# Altium project LoRa.PrjPcb
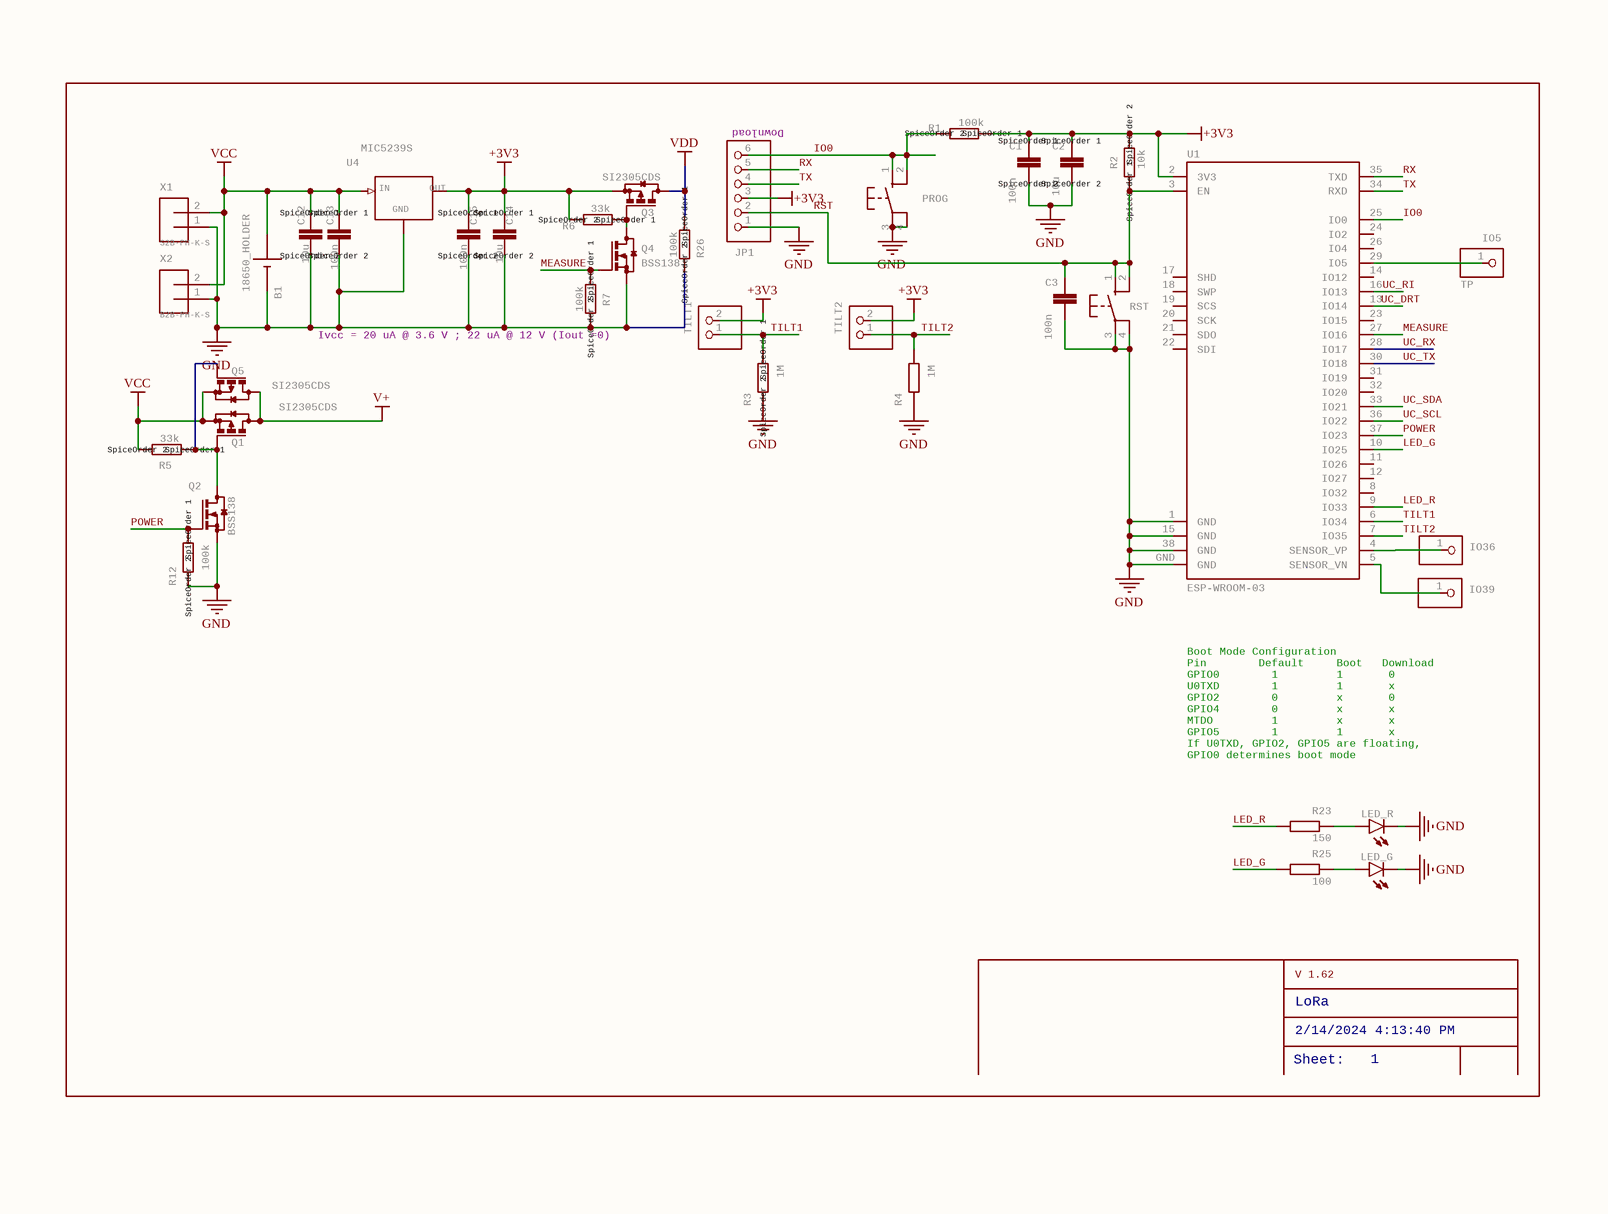
[diagram p0: LoRa_0.SchDoc]
2 sheets, 79 parts. Net scope: global (net labels, ports and power ports of the same name join across sheets).
Sheets:
  LoRa_0.SchDoc
  LoRa_1.SchDoc

## Sheet LoRa_0.SchDoc: LoRa
size 282 x 212 mm; Origin: Eagle; Date: 2/14/2024 4:13:40 PM; SheetNumber: 1; GateName_1: G$1; SymbolName_1: A4L-LOC; LibraryName: frames; DeviceSetName: A4L-LOC; Sheet: Sheet:

### Parts
B1  18650_HOLDER  [18650]
C1  100n  SpiceOrder1: SpiceOrder 1  SpiceOrder2: SpiceOrder 2  [C1206]
C2  10u  SpiceOrder1: SpiceOrder 1  SpiceOrder2: SpiceOrder 2  [C1210]
C3  100n  [C1206]
C12  10u  SpiceOrder1: SpiceOrder 1  SpiceOrder2: SpiceOrder 2  [C1210]
C13  100n  SpiceOrder1: SpiceOrder 1  SpiceOrder2: SpiceOrder 2  [C1206]
C14  10u  SpiceOrder1: SpiceOrder 1  SpiceOrder2: SpiceOrder 2  [C1210]
C15  100n  SpiceOrder1: SpiceOrder 1  SpiceOrder2: SpiceOrder 2  [C1206]
IO5  TP  [1X01]
IO36  PINHD-1X1  [1X01]  (value not drawn)
IO39  PINHD-1X1  [1X01]  (value not drawn)
JP1  PINHD-1X6  [1X06]  (value not drawn)
LED_G  LEDSMT1206  [1206]  (value not drawn)
LED_R  LEDSMT1206  [1206]  (value not drawn)
PROG  10-XX  [B3F-10XX]  (value not drawn)
Q1  SI2305CDS  [SOT23]
Q2  BSS138  [SOT23]
Q3  SI2305CDS  [SOT23]
Q4  BSS138  [SOT23]
Q5  SI2305CDS  [SOT23]
R1  100k  SpiceOrder1: SpiceOrder 1  SpiceOrder2: SpiceOrder 2  [R1206]
R2  10k  SpiceOrder1: SpiceOrder 1  SpiceOrder2: SpiceOrder 2  [R1206]
R3  1M  SpiceOrder1: SpiceOrder 1  SpiceOrder2: SpiceOrder 2  [R1206]
R4  1M  [R1206]
R5  33k  SpiceOrder1: SpiceOrder 1  SpiceOrder2: SpiceOrder 2  [R1206]
R6  33k  SpiceOrder1: SpiceOrder 1  SpiceOrder2: SpiceOrder 2  [R1206]
R7  100k  SpiceOrder1: SpiceOrder 1  SpiceOrder2: SpiceOrder 2  [R1206]
R12  100k  SpiceOrder1: SpiceOrder 1  SpiceOrder2: SpiceOrder 2  [R1206]
R23  150  [R1206]
R25  100  [R1206]
R26  100k  SpiceOrder1: SpiceOrder 1  SpiceOrder2: SpiceOrder 2  [R1206]
RST  10-XX  [B3F-10XX]  (value not drawn)
TILT1  PINHD-1X2  [1X02]  (value not drawn)
TILT2  PINHD-1X2  [1X02]  (value not drawn)
U1  ESP-WROOM-03  [ESP-WROOM-03]
U4  MIC5239S  [SOT223]
X1  S2B-PH-K-S  [S2B-PH-K-S]
X2  B2B-PH-K-S  [B2B-PH-K-S]

### Nets
+3V3: C1.1 C2.1 C14.1 C15.1 JP1.3 Q3.2(S) R1.1 R2.2 R6.2 TILT1.2 TILT2.2 U1.2(3V3) U4.3(OUT)
GND: B1.- C1.2 C2.2 C3.2 C12.2 C13.2 C14.2 C15.2 JP1.1 LED_G.C LED_R.C PROG.3(P) PROG.4(P1) Q2.2(S) Q4.2(S) R3.2 R4.2 R7.2 R12.2 R26.2 RST.3(P) RST.4(P1) U1.1(GND) U1.15(GND) U1.38(GND) U1.GND U4.2,4(GND) X1.1 X2.1
V+: Q1.3(D) Q5.3(D)
VCC: B1.+ C12.1 C13.1 Q1.2(S) Q5.2(S) R5.2 U4.1(IN) X1.2 X2.2
VDD: Q3.3(D) R26.1
IO0: JP1.6 PROG.1(S) PROG.2(S1) R1.2 U1.25(IO0)
LED_G: R25.1 U1.10(IO25)
LED_R: R23.1 U1.9(IO33)
MEASURE: Q4.1(G) R7.1 U1.27(IO16)
POWER: Q2.1(G) R12.1 U1.37(IO23)
RST: C3.1 JP1.2 R2.1 RST.1(S) RST.2(S1) U1.3(EN)
RX: JP1.5 U1.35(TXD)
TILT1: R3.1 TILT1.1 U1.6(IO34)
TILT2: R4.1 TILT2.1 U1.7(IO35)
TX: JP1.4 U1.34(RXD)
UC_DRT: U1.13(IO14)
UC_RI: U1.16(IO13)
UC_RX: U1.28(IO17)
UC_SCL: U1.36(IO22)
UC_SDA: U1.33(IO21)
UC_TX: U1.30(IO18)
NetIO5_1: IO5.1 U1.29(IO5)
NetIO36_1: IO36.1 U1.4(SENSOR_VP)
NetIO39_1: IO39.1 U1.5(SENSOR_VN)
NetLED_G_A: LED_G.A R25.2
NetLED_R_A: LED_R.A R23.2
NetQ1_1: Q1.1(G) Q2.3(D) Q5.1(G) R5.1
NetQ3_1: Q3.1(G) Q4.3(D) R6.1

Not connected (* = marked no-connect by the designer): U1 8(IO32) 11(IO26) 12(IO27) 14(IO12) 17(SHD) 18(SWP) 19(SCS) 20(SCK) 21(SDO) 22(SDI) 23(IO15) 24(IO2) 26(IO4) 31(IO19) 32(IO20)

### Notes on the sheet
- (near JP1) Download
- (near R7) Ivcc = 20 uA @ 3.6 V ; 22 uA @ 12 V (Iout =0)
- Boot Mode Configuration
  Pin        Default     Boot   Download
  GPIO0        1         1       0
  U0TXD        1         1       x
  GPIO2        0         x       0
  GPIO4        0         x       x
  MTDO         1         x       x
  GPIO5        1         1       x
  If U0TXD, GPIO2, GPIO5 are floating,
  GPIO0 determines boot mode
- V 1.62
- LoRa
- Sheet:
- 2/14/2024 4:13:40 PM
- 1

### Library data of the parts
B1 = 18650_HOLDER: 18650 holder; GateName_1: G$1; SymbolName_1: 1V2; LibraryName: battery_bms; DeviceSetName: 18650_HOLDER
C1 C3 C13 C15 = CC1206: CAPACITOR, European symbol; GateName_1: G$1; SymbolName_1: C; DeviceName: C1206; LibraryName: eagle-ltspice; DeviceSetName: C; SPICEMODEL: NONE; SPICEPREFIX: C
C2 C12 C14 = CC1210: CAPACITOR, European symbol; GateName_1: G$1; SymbolName_1: C; DeviceName: C1210; LibraryName: eagle-ltspice; DeviceSetName: C; SPICEMODEL: NONE; SPICEPREFIX: C
IO5 IO36 IO39 = PINHD-1X1: PIN HEADER; GateName_1: G$1; SymbolName_1: PINHD1; POPULARITY: 64; LibraryName: pinhead; DeviceSetName: PINHD-1X1
JP1 = PINHD-1X6: PIN HEADER; GateName_1: A; SymbolName_1: PINHD6; POPULARITY: 79; LibraryName: pinhead; DeviceSetName: PINHD-1X6
LED_G LED_R = LEDSMT1206: LED   OSRAM: - CHIPLED LG R971, LG N971, LY N971, LG Q971, LY Q971, LO R971, LY R971 LH N974, LH R974 LS Q976, LO Q976, LY Q976 LO Q996 - Hyper CHIPLED LW Q18S LB Q993, LB Q99A, LB R99A - SideLED LS A670, LO A670, LY A670, LG A670, LP A670 LB A673, LV A673, LT A673, LW A673 LH A674 LY A675 LS A676, LA A676, LO A676, LY A676, LW A676 LS A679, LY A679, LG A679 -  Hyper Micro SIDELEDÂ® LS Y876, LA Y876, LO Y876, LY Y876 LT Y87S - SmartLED LW L88C, LW L88S LB L89C, LB L89S, LG L890 LS L89K, LO L89K, LY L89K LS L896, LA L896, LO L896, LY L896 - TOPLED LS T670, LO T670, LY T670, LG T670, LP T670 LSG T670, LSP T670, LSY T670, LOP T670, LYG T670 LG T671, LOG T671, LSG T671 LB T673, LV T673, LT T673, LW T673 LH T674 LS T676, LA T676, LO T676, LY T676, LB T676, LH T676, LSB T676, LW T676 LB T67C, LV T67C, LT T67C, LS T67K, LO T67K, LY T67K, LW E67C LS E67B, LA E67B, LO E67B, LY E67B, LB E67C, LV E67C, LT E67C LW T67C LS T679, LY T679, LG T679 LS T770, LO T770, LY T770, LG T770, LP T770 LB T773, LV T773, LT T773, LW T773 LH T774 LS E675, LA E675, LY E675, LS T675 LS T776, LA T776, LO T776, LY T776, LB T776 LHGB T686 LT T68C, LB T68C - Hyper Mini TOPLEDÂ® LB M676 - Mini TOPLED SantanaÂ® LG M470 LS M47K, LO M47K, LY M47K    Source: http://www.osram.convergy.de   LUXEON: - LUMILEDÂ® LXK2-PW12-R00, LXK2-PW12-S00, LXK2-PW14-U00, LXK2-PW14-V00 LXK2-PM12-R00, LXK2-PM12-S00, LXK2-PM14-U00 LXK2-PE12-Q00, LXK2-PE12-R00, LXK2-PE12-S00, LXK2-PE14-T00, LXK2-PE14-U00 LXK2-PB12-K00, LXK2-PB12-L00, LXK2-PB12-M00, LXK2-PB14-N00, LXK2-PB14-P00, LXK2-PB14-Q00 LXK2-PR12-L00, LXK2-PR12-M00, LXK2-PR14-Q00, LXK2-PR14-R00 LXK2-PD12-Q00, LXK2-PD12-R00, LXK2-PD12-S00 LXK2-PH12-R00, LXK2-PH12-S00 LXK2-PL12-P00, LXK2-PL12-Q00, LXK2-PL12-R00    Source: www.luxeon.com   KINGBRIGHT:   KA-3528ASYC Source: www.kingbright.com; GateName_1: G$1; POPULARITY: 20; SymbolName_1: LED; DeviceName: SMT1206; LibraryName: led; DeviceSetName: LED
PROG RST = 10-XX: OMRON SWITCH; MPN: B3F-1000; GateName_1: 1; SymbolName_1: TS2; POPULARITY: 72; LibraryName: switch-omron; DeviceSetName: 10-XX; MF: MF; OC_FARNELL: 176432; OC_NEWARK: 36M3542
Q1 Q3 Q5 = SI2305CDS: P-CHANNEL MOS FET; GateName_1: G$1; SymbolName_1: P-MOS; LibraryName: transistor-small-signal-perso; DeviceSetName: SI2305CDS
Q2 Q4 = BSS131: N-CHANNEL MOS FET; GateName_1: G$1; SymbolName_1: N-MOS; LibraryName: transistor-small-signal-perso; DeviceSetName: BSS131
R1-R7 R12 R23 R25 = RR1206: RESISTOR, European symbol; GateName_1: G$1; SymbolName_1: R; DeviceName: R1206; LibraryName: eagle-ltspice; DeviceSetName: R; SPICEMODEL: NONE; SPICEPREFIX: R
R26 = RR1206: RESISTOR, European symbol; GateName_1: G$1; SymbolName_1: R26; DeviceName: R1206; LibraryName: eagle-ltspice; DeviceSetName: R26; SPICEMODEL: NONE; SPICEPREFIX: R
TILT1 TILT2 = PINHD-1X2: PIN HEADER; GateName_1: G$1; SymbolName_1: PINHD2; POPULARITY: 98; LibraryName: pinhead; DeviceSetName: PINHD-1X2
U1 = ESP-WROOM-03: GateName_1: G$1; SymbolName_1: ESP-WROOM-03; LibraryName: esp32-sparkfun (1); DeviceSetName: ESP-WROOM-03; MF: MF; MPN: MPN; OC_FARNELL: unknown
U4 = MIC5239S: LDO REGULATOR; GateName_1: G$1; SymbolName_1: MIC5239S; LibraryName: micrel; DeviceSetName: MIC5239S; GND: GND; IN: IN; OUT: OUT
X1 = S2B-PH-K-S: JST PH series header 2.00mm pitch disconnectable crimp style connectors, horizontal (side entry type), 2 pins; GateName_1: G$1; SymbolName_1: M_1R02; DeviceName: -K-S; DeviceSetName: S2B-PH; LibraryName: con-JST PH
X2 = B2B-PH-K-S: JST PH series header 2.00mm pitch disconnectable crimp style connectors, vertical (side entry type), 2 pins; GateName_1: G$1; SymbolName_1: M_1R02; DeviceName: -K-S; DeviceSetName: B2B-PH; LibraryName: con-JST PH

## Sheet LoRa_1.SchDoc
size 354 x 244 mm; Origin: Eagle
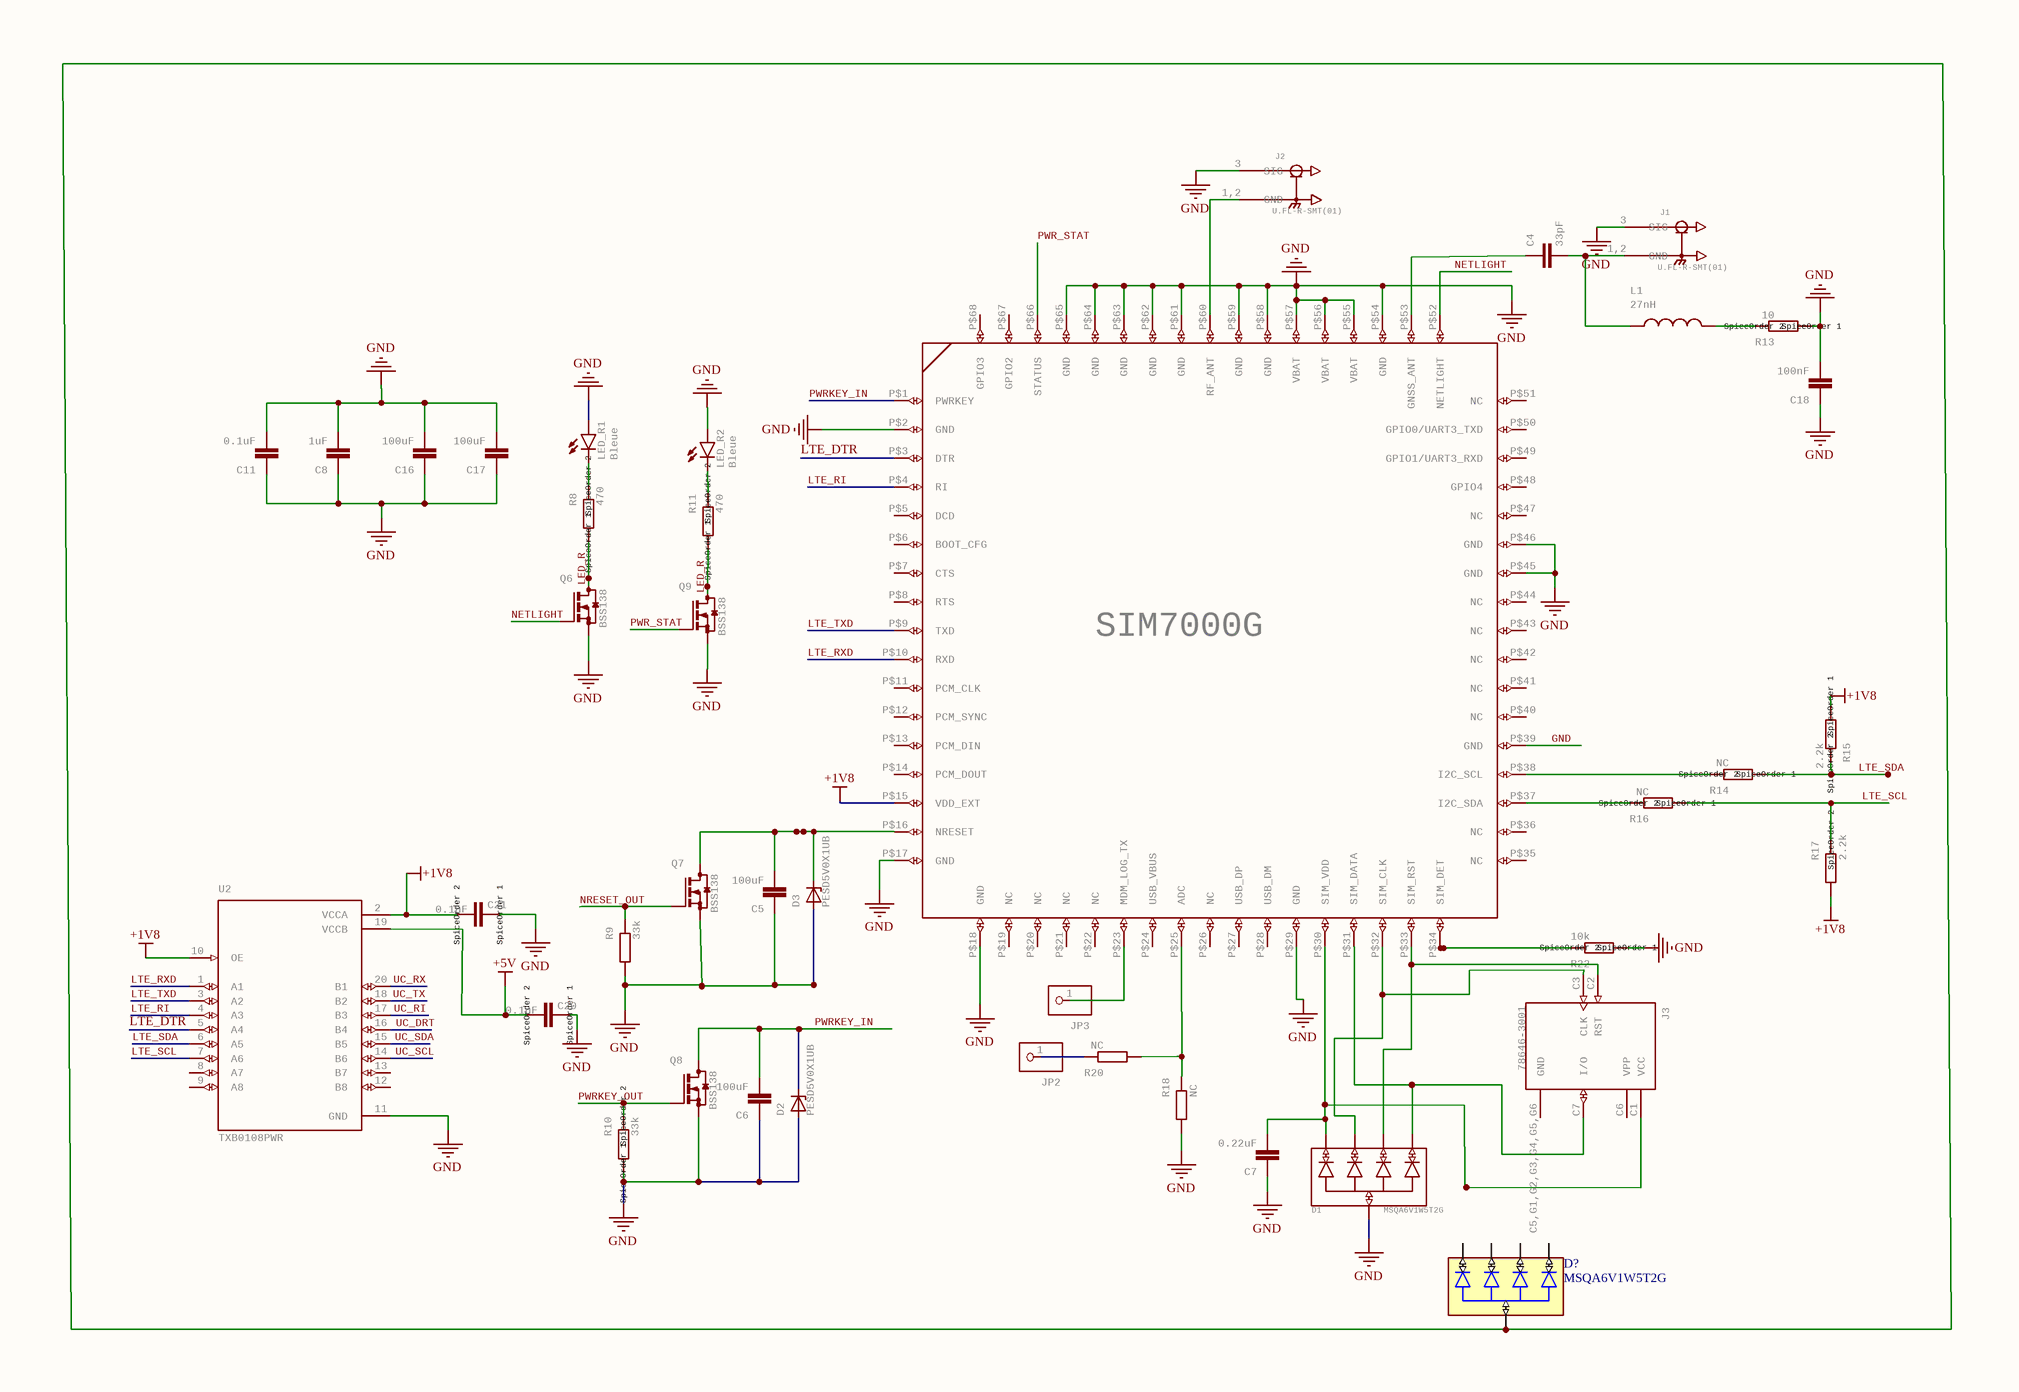
[diagram p1: LoRa_1.SchDoc]

### Parts
C4  33pF  [C0805]
C5  100uF  [C0805]
C6  100uF  [C0805]
C7  0.22uF  [C0805]
C8  1uF  [C0805]
C11  0.1uF  [C0805]
C16  100uF  [C0805]
C17  100uF  [C0805]
C18  100nF  [C0805]
C20  0.1uF  SpiceOrder1: SpiceOrder 1  SpiceOrder2: SpiceOrder 2  [C1210]
C21  0.1uF  SpiceOrder1: SpiceOrder 1  SpiceOrder2: SpiceOrder 2  [C1210]
D1  MSQA6V1W5T2G  [SC88A]
D2  PESD5V0X1UB  [SOD523]
D3  PESD5V0X1UB  [SOD523]
D?  MSQA6V1W5T2G  [SC88A]
J1  U.FL-R-SMT(01)  [HRS_U.FL-R-SMT(01)]
J2  U.FL-R-SMT(01)  [HRS_U.FL-R-SMT(01)]
J3  78646-3001  [MOLEX_78646-3001]
JP2  PINHD-1X1  [1X01]  (value not drawn)
JP3  PINHD-1X1  [1X01]  (value not drawn)
L1  27nH  [INDC2012X100N]
LED_R1  Bleue  [1206]
LED_R2  Bleue  [1206]
Q6  BSS138  [SOT23]
Q7  BSS138  [SOT23]
Q8  BSS138  [SOT23]
Q9  BSS138  [SOT23]
R8  470  SpiceOrder1: SpiceOrder 1  SpiceOrder2: SpiceOrder 2  [R1206]
R9  33k  [R1206]
R10  33k  SpiceOrder1: SpiceOrder 1  SpiceOrder2: SpiceOrder 2  [R1206]
R11  470  SpiceOrder1: SpiceOrder 1  SpiceOrder2: SpiceOrder 2  [R1206]
R13  10  SpiceOrder1: SpiceOrder 1  SpiceOrder2: SpiceOrder 2  [R1206]
R14  NC  SpiceOrder1: SpiceOrder 1  SpiceOrder2: SpiceOrder 2  [R1206]
R15  2.2k  SpiceOrder1: SpiceOrder 1  SpiceOrder2: SpiceOrder 2  [R1206]
R16  NC  SpiceOrder1: SpiceOrder 1  SpiceOrder2: SpiceOrder 2  [R1206]
R17  2.2k  SpiceOrder2: SpiceOrder 2  [R1206]
R18  NC  [R1206]
R20  NC  [R1206]
R22  10k  SpiceOrder1: SpiceOrder 1  SpiceOrder2: SpiceOrder 2  [R1206]
U2  TXB0108PWR  [SOP65P640X120-20N]
U$1  SIM7000G  [SIM7000G]

### Nets
+1V8: C21.2 R15.1 R17.1 U2.2(VCCA) U2.10(OE) U$1.P$15(VDD_EXT)
+5V: C20.2 U2.19(VCCB)
GND: C5.1 C6.1 C7.1 C8.1 C8.2 C11.1 C11.2 C16.1 C16.2 C17.1 C17.2 C18.1 C18.2 C20.1 C21.1 D1.2(P$2) D2.2(A) D3.2(A) J1.3(SIG) J2.3(SIG) LED_R1.A LED_R2.A Q6.2(S) Q7.2(S) Q8.2(S) Q9.2(S) R9.1 R10.1 R13.1 R18.1 R22.1 U2.11(GND) U$1.P$2(GND) U$1.P$17(GND) U$1.P$18(GND) U$1.P$29(GND) U$1.P$39(GND) U$1.P$45(GND) U$1.P$46(GND) U$1.P$54(GND) U$1.P$55(VBAT) U$1.P$56(VBAT) U$1.P$57(VBAT) U$1.P$58(GND) U$1.P$59(GND) U$1.P$61(GND) U$1.P$62(GND) U$1.P$63(GND) U$1.P$64(GND) U$1.P$65(GND)
LED_R: Q6.3(D) Q9.3(D) R8.1 R11.1
LTE_DTR: U2.5(A4) U$1.P$3(DTR)
LTE_RI: U2.4(A3) U$1.P$4(RI)
LTE_RXD: U2.1(A1) U$1.P$10(RXD)
LTE_SCL: R16.1 R17.2 U2.7(A6)
LTE_SDA: R14.1 R15.2 U2.6(A5)
LTE_TXD: U2.3(A2) U$1.P$9(TXD)
NETLIGHT: Q6.1(G) U$1.P$52(NETLIGHT)
NRESET_OUT: Q7.1(G) R9.2
PWR_STAT: Q9.1(G) U$1.P$66(STATUS)
PWRKEY_IN: C6.2 D2.1(K) Q8.3(D) U$1.P$1(PWRKEY)
PWRKEY_OUT: Q8.1(G) R10.2
UC_DRT: U2.16(B4)
UC_RI: U2.17(B3)
UC_RX: U2.20(B1)
UC_SCL: U2.14(B6)
UC_SDA: U2.15(B5)
UC_TX: U2.18(B2)
NetC4_1: C4.1 U$1.P$53(GNSS_ANT)
NetC4_2: C4.2 J1.1,2(GND) L1.1
NetC5_2: C5.2 D3.1(K) Q7.3(D) U$1.P$16(NRESET)
NetC7_2: C7.2 D1.1(P$1) J3.C1(VCC) U$1.P$30(SIM_VDD)
NetD1_3: D1.3(P$3) J3.C3(CLK) U$1.P$32(SIM_CLK)
NetD1_4: D1.4(P$4) J3.C2(RST) U$1.P$33(SIM_RST)
NetD1_5: D1.5(P$5) J3.C7(I/O) U$1.P$31(SIM_DATA)
NetJ2_1,2: J2.1,2(GND) U$1.P$60(RF_ANT)
NetJP2_1: JP2.1 R20.2
NetJP3_1: JP3.1 U$1.P$23(MDM_LOG_TX)
NetL1_2: L1.2 R13.2
NetLED_R1_C: LED_R1.C R8.2
NetLED_R2_C: LED_R2.C R11.2
NetR14_2: R14.2 U$1.P$38(I2C_SCL)
NetR16_2: R16.2 U$1.P$37(I2C_SDA)
NetR18_2: R18.2 R20.1 U$1.P$25(ADC)
NetR22_2: R22.2 U$1.P$34(SIM_DET)

Not connected (* = marked no-connect by the designer): D? 1(P$1) 2(P$2) 3(P$3) 4(P$4) 5(P$5); J3 C5,G1,G2,G3,G4,G5,G6(GND) C6(VPP); U2 8(A7) 9(A8) 12(B8) 13(B7); U$1 P$5(DCD) P$6(BOOT_CFG) P$7(CTS) P$8(RTS) P$11(PCM_CLK) P$12(PCM_SYNC) P$13(PCM_DIN) P$14(PCM_DOUT) P$19(NC) P$20(NC) P$21(NC) P$22(NC) P$24(USB_VBUS) P$26(NC) P$27(USB_DP) P$28(USB_DM) P$35(NC) P$36(NC) P$40(NC) P$41(NC) P$42(NC) P$43(NC) P$44(NC) P$47(NC) P$48(GPIO4) P$49(GPIO1/UART3_RXD) P$50(GPIO0/UART3_TXD) P$51(NC) P$67(GPIO2) P$68(GPIO3)

### Library data of the parts
C4-C8 C11 C16-C18 = C-EUC0805: CAPACITOR, European symbol; GateName_1: G$1; SymbolName_1: C-EU; POPULARITY: 88; DeviceName: C0805; LibraryName: rcl; DeviceSetName: C-EU; SPICEPREFIX: C
C20 C21 = CC1210: as C2 on sheet LoRa_0; DeviceName: C1210; LibraryName: eagle-ltspice; DeviceSetName: C; SPICEMODEL: NONE; SPICEPREFIX: C
D1 = MSQA6V1W5T2G: ESD Protection Diode Array  Check availability; GateName_1: G$1; SymbolName_1: QUAD_DIODE; MF: onsemi; LibraryName: MSQA6V1W5T2G; DeviceSetName: MSQA6V1W5T2G; AVAILABILITY: In Stock; CHECK_PRICES: https://www.snapeda.com/parts/MSQA6V1W5T2G/Onsemi/view-part/?ref=eda; MP: MSQA6V1W5T2G; PACKAGE: SC-88A-5 ON Semiconductor; PRICE: None; PURCHASE-URL: https://www.snapeda.com/api/url_track_click_mouser/?unipart_id=7122110&manufacturer=onsemi&part_name=MSQA6V1W5T2G&search_term=msqa6v1w5t2g; SNAPEDA_LINK: https://www.snapeda.com/parts/MSQA6V1W5T2G/Onsemi/view-part/?ref=snap
D2 D3 = PESD5V0X1UB: Ultra low capacitance unidirectional ElectroStatic Discharge (ESD) protection diode in a SOD523 (SC-79) ultra small and flat lead Surface-Mounted Device (SMD) plastic package designed to protect one signal line from the damage caused by ESD and other transients.   AAL Eindhoven MK    Check availability; GateName_1: G$1; SymbolName_1: DIODE_ESD; MF: Nexperia USA; LibraryName: PESD5V0X1UB; DeviceSetName: PESD5V0X1UB; AVAILABILITY: In Stock; CHECK_PRICES: https://www.snapeda.com/parts/PESD5V0X1UB/Nexperia/view-part/?ref=eda; MP: PESD5V0X1UB; PACKAGE: SOD-523 NXP Semiconductors; PRICE: None; SNAPEDA_LINK: https://www.snapeda.com/parts/PESD5V0X1UB/Nexperia/view-part/?ref=snap
D? = MSQA6V1W5T2G: - Clamp - Ipp Tvs Diode Surface Mount SC-88A (SC-70-5/SOT-353); MF: ON Semiconductor; Price: None; Value: *; Purchase-URL: https://pricing.snapeda.com/search/part/MSQA6V1W5T2G/?ref=eda; Check_prices: https://www.snapeda.com/parts/MSQA6V1W5T2G/Onsemi/view-part/?ref=eda; Package: SC-88A-5 ON Semiconductor; Availability: In Stock; SnapEDA_Link: https://www.snapeda.com/parts/MSQA6V1W5T2G/Onsemi/view-part/?ref=snap; MP: MSQA6V1W5T2G
J1 J2 = U.FL-R-SMT(01): U.FL Series 6 Ghz 50 Ohm Ultra-small SMT Coaxial Cable Receptacle Check availability; GateName_1: G$1; MF: Hirose; SymbolName_1: U.FL-R-SMT(01); LibraryName: U.FL-R-SMT_01_; DeviceSetName: U.FL-R-SMT(01); AVAILABILITY: In Stock; CHECK_PRICES: https://www.snapeda.com/parts/U.FL-R-SMT(01)/Hirose+Electric+Co+Ltd/view-part/?ref=eda; MP: U.FL-R-SMT(01); PACKAGE: None; PRICE: None; PURCHASE-URL: https://www.snapeda.com/api/url_track_click_mouser/?unipart_id=49572&manufacturer=Hirose&part_name=U.FL-R-SMT(01)&search_term=None; SNAPEDA_LINK: https://www.snapeda.com/parts/U.FL-R-SMT(01)/Hirose+Electric+Co+Ltd/view-part/?ref=snap
J3 = 78646-3001: Conn Micro SIM Card SKT 6 POS 2.54mm Solder RA SMD 0.5A/Contact Embossed T/R Check availability; GateName_1: G$1; MF: Molex; SymbolName_1: 78646-3001; LibraryName: SIM; DeviceSetName: 78646-3001; AVAILABILITY: In Stock; CHECK_PRICES: https://www.snapeda.com/parts/78646-3001/Molex/view-part/?ref=eda; MP: 78646-3001; PACKAGE: None; PRICE: None; PURCHASE-URL: https://www.snapeda.com/api/url_track_click_mouser/?unipart_id=75189&manufacturer=Molex&part_name=78646-3001&search_term=micro sim; SNAPEDA_LINK: https://www.snapeda.com/parts/78646-3001/Molex/view-part/?ref=snap
JP2 JP3 = PINHD-1X1: as IO5 on sheet LoRa_0; LibraryName: pinhead; DeviceSetName: PINHD-1X1
L1 = LQM21PN1R0NGRD: LQM21PN 1uH 950mA 30% MLT; GateName_1: G$1; MF: Murata; SymbolName_1: LQM21PN1R0NGRD; LibraryName: LQM21PN1R0NGRD; DeviceSetName: LQM21PN1R0NGRD; CHECK_PRICES: https://www.snapeda.com/parts/LQM21PN1R0NGRD/Murata+Electronics+North+America/view-part/?ref=eda; MP: LQM21PN1R0NGRD; PACKAGE: 2012 Murata; PURCHASE-URL: https://www.snapeda.com/api/url_track_click_mouser/?unipart_id=1499484&manufacturer=Murata&part_name=LQM21PN1R0NGRD&search_term=inductance 0805; RS_COMPONENTS_1674235_PURCHASE_URL: https://www.snapeda.com/api/url_track_click/https%253A//uk.rs-online.com/web/p/surface-mount-inductors/1674235//%253Futm_campaign%253Dbuynow%2526utm_medium%253Daggregator%2526utm_source%253Dsnapeda%2526cm_mmc%253Daff-_-uk-_-snapeda-_-1674235/?unipart_id=1499484&manufacturer=Murata&part_name=LQM21PN1R0NGRD&search_term=inductance 0805; RS_COMPONENTS_7867096_PURCHASE_URL: https://www.snapeda.com/api/url_track_click/https%253A//uk.rs-online.com/web/p/surface-mount-inductors/7867096//%253Futm_campaign%253Dbuynow%2526utm_medium%253Daggregator%2526utm_source%253Dsnapeda%2526cm_mmc%253Daff-_-uk-_-snapeda-_-7867096/?unipart_id=1499484&manufacturer=Murata&part_name=LQM21PN1R0NGRD&search_term=inductance 0805; RS_COMPONENTS_7867096P_PURCHASE_URL: https://www.snapeda.com/api/url_track_click/https%253A//uk.rs-online.com/web/p/surface-mount-inductors/7867096p//%253Futm_campaign%253Dbuynow%2526utm_medium%253Daggregator%2526utm_source%253Dsnapeda%2526cm_mmc%253Daff-_-uk-_-snapeda-_-7867096P/?unipart_id=1499484&manufacturer=Murata&part_name=LQM21PN1R0NGRD&search_term=inductance 0805; SNAPEDA_LINK: https://www.snapeda.com/parts/LQM21PN1R0NGRD/Murata+Electronics+North+America/view-part/?ref=snap
LED_R1 LED_R2 = LEDSMT1206: as LED_G on sheet LoRa_0; SymbolName_1: LED; DeviceName: SMT1206; LibraryName: led; DeviceSetName: LED
Q6-Q9 = BSS131: as Q2 on sheet LoRa_0; LibraryName: transistor-small-signal-perso; DeviceSetName: BSS131
R8-R11 R13-R18 R20 R22 = RR1206: as R1 on sheet LoRa_0; DeviceName: R1206; LibraryName: eagle-ltspice; DeviceSetName: R; SPICEMODEL: NONE; SPICEPREFIX: R
U2 = TXB0108PWR: 8-Bit Bidirectional Voltage-Level Shifter with Auto Direction Sensing and +/-15-kV ESD Protect 20-TSSOP -40 to 85  Check availability; GateName_1: G$1; MF: Texas Instruments; SymbolName_1: TXB0108PWR; LibraryName: TXB0108PWR; DeviceSetName: TXB0108PWR; CHECK_PRICES: https://www.snapeda.com/parts/TXB0108PWR/Texas+Instruments/view-part/?ref=eda; MP: TXB0108PWR; PACKAGE: TSSOP-20 Texas Instruments; PURCHASE-URL: https://www.snapeda.com/api/url_track_click_mouser/?unipart_id=45111&manufacturer=Texas Instruments&part_name=TXB0108PWR&search_term=txb0108; RS_COMPONENTS_7099038_PURCHASE_URL: https://www.snapeda.com/api/url_track_click/https%253A//uk.rs-online.com/web/p/translator-ics/7099038//%253Futm_campaign%253Dbuynow%2526utm_medium%253Daggregator%2526utm_source%253Dsnapeda%2526cm_mmc%253Daff-_-uk-_-snapeda-_-7099038/?unipart_id=45111&manufacturer=Texas Instruments&part_name=TXB0108PWR&search_term=txb0108; RS_COMPONENTS_7099038P_PURCHASE_URL: https://www.snapeda.com/api/url_track_click/https%253A//uk.rs-online.com/web/p/translator-ics/7099038p//%253Futm_campaign%253Dbuynow%2526utm_medium%253Daggregator%2526utm_source%253Dsnapeda%2526cm_mmc%253Daff-_-uk-_-snapeda-_-7099038P/?unipart_id=45111&manufacturer=Texas Instruments&part_name=TXB0108PWR&search_term=txb0108; RS_COMPONENTS_9215119_PURCHASE_URL: https://www.snapeda.com/api/url_track_click/https%253A//uk.rs-online.com/web/p/translator-ics/9215119//%253Futm_campaign%253Dbuynow%2526utm_medium%253Daggregator%2526utm_source%253Dsnapeda%2526cm_mmc%253Daff-_-uk-_-snapeda-_-9215119/?unipart_id=45111&manufacturer=Texas Instruments&part_name=TXB0108PWR&search_term=txb0108; SNAPEDA_LINK: https://www.snapeda.com/parts/TXB0108PWR/Texas+Instruments/view-part/?ref=snap
U$1 = SIM7000G: GateName_1: G$1; MF: SIMCom Wireless Solutions Limited; SymbolName_1: SIM7000G; LibraryName: SIM7000G; DeviceSetName: SIM7000G; SIM7000G: SIM7000G; CHECK_PRICES: https://www.snapeda.com/parts/SIM7000G/SIMCom/view-part/?ref=eda; DIGIKEY_PART_NUMBER: DIGIKEY_PART_NUMBER; MP: SIM7000G; PACKAGE: None; PURCHASE-URL: https://www.snapeda.com/api/url_track_click_mouser/?unipart_id=12130268&manufacturer=SIMCom Wireless Solutions Limited&part_name=SIM7000G&search_term=sim7000g; SNAPEDA_LINK: https://www.snapeda.com/parts/SIM7000G/SIMCom/view-part/?ref=snap

## Nets that join several sheets
GND: LoRa_0 (29 pins), LoRa_1 (50 pins)
LED_R: LoRa_0 (R23.1 U1.9), LoRa_1 (Q6.3 Q9.3 R8.1 R11.1)
UC_DRT: LoRa_0 (U1.13), LoRa_1 (U2.16)
UC_RI: LoRa_0 (U1.16), LoRa_1 (U2.17)
UC_RX: LoRa_0 (U1.28), LoRa_1 (U2.20)
UC_SCL: LoRa_0 (U1.36), LoRa_1 (U2.14)
UC_SDA: LoRa_0 (U1.33), LoRa_1 (U2.15)
UC_TX: LoRa_0 (U1.30), LoRa_1 (U2.18)